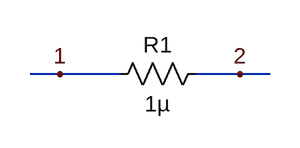
[diagram p0: schematic current_arrow.asc]
current_arrow.asc, the LTspice schematic file:
Version 4
SHEET 1 880 680
WIRE 80 176 48 176
WIRE 144 176 80 176
WIRE 272 176 224 176
WIRE 304 176 272 176
FLAG 80 176 1
FLAG 272 176 2
SYMBOL res 240 160 R90
WINDOW 0 0 56 VBottom 2
WINDOW 3 32 56 VTop 2
SYMATTR InstName R1
SYMATTR Value 1µ

The netlist it stands for:
* current_arrow.asc
R1 2 1 1µ
.backanno
.end